# EAGLE design Grownetics 3D Crop Sensor Shield (EAGLE 7.6.0)
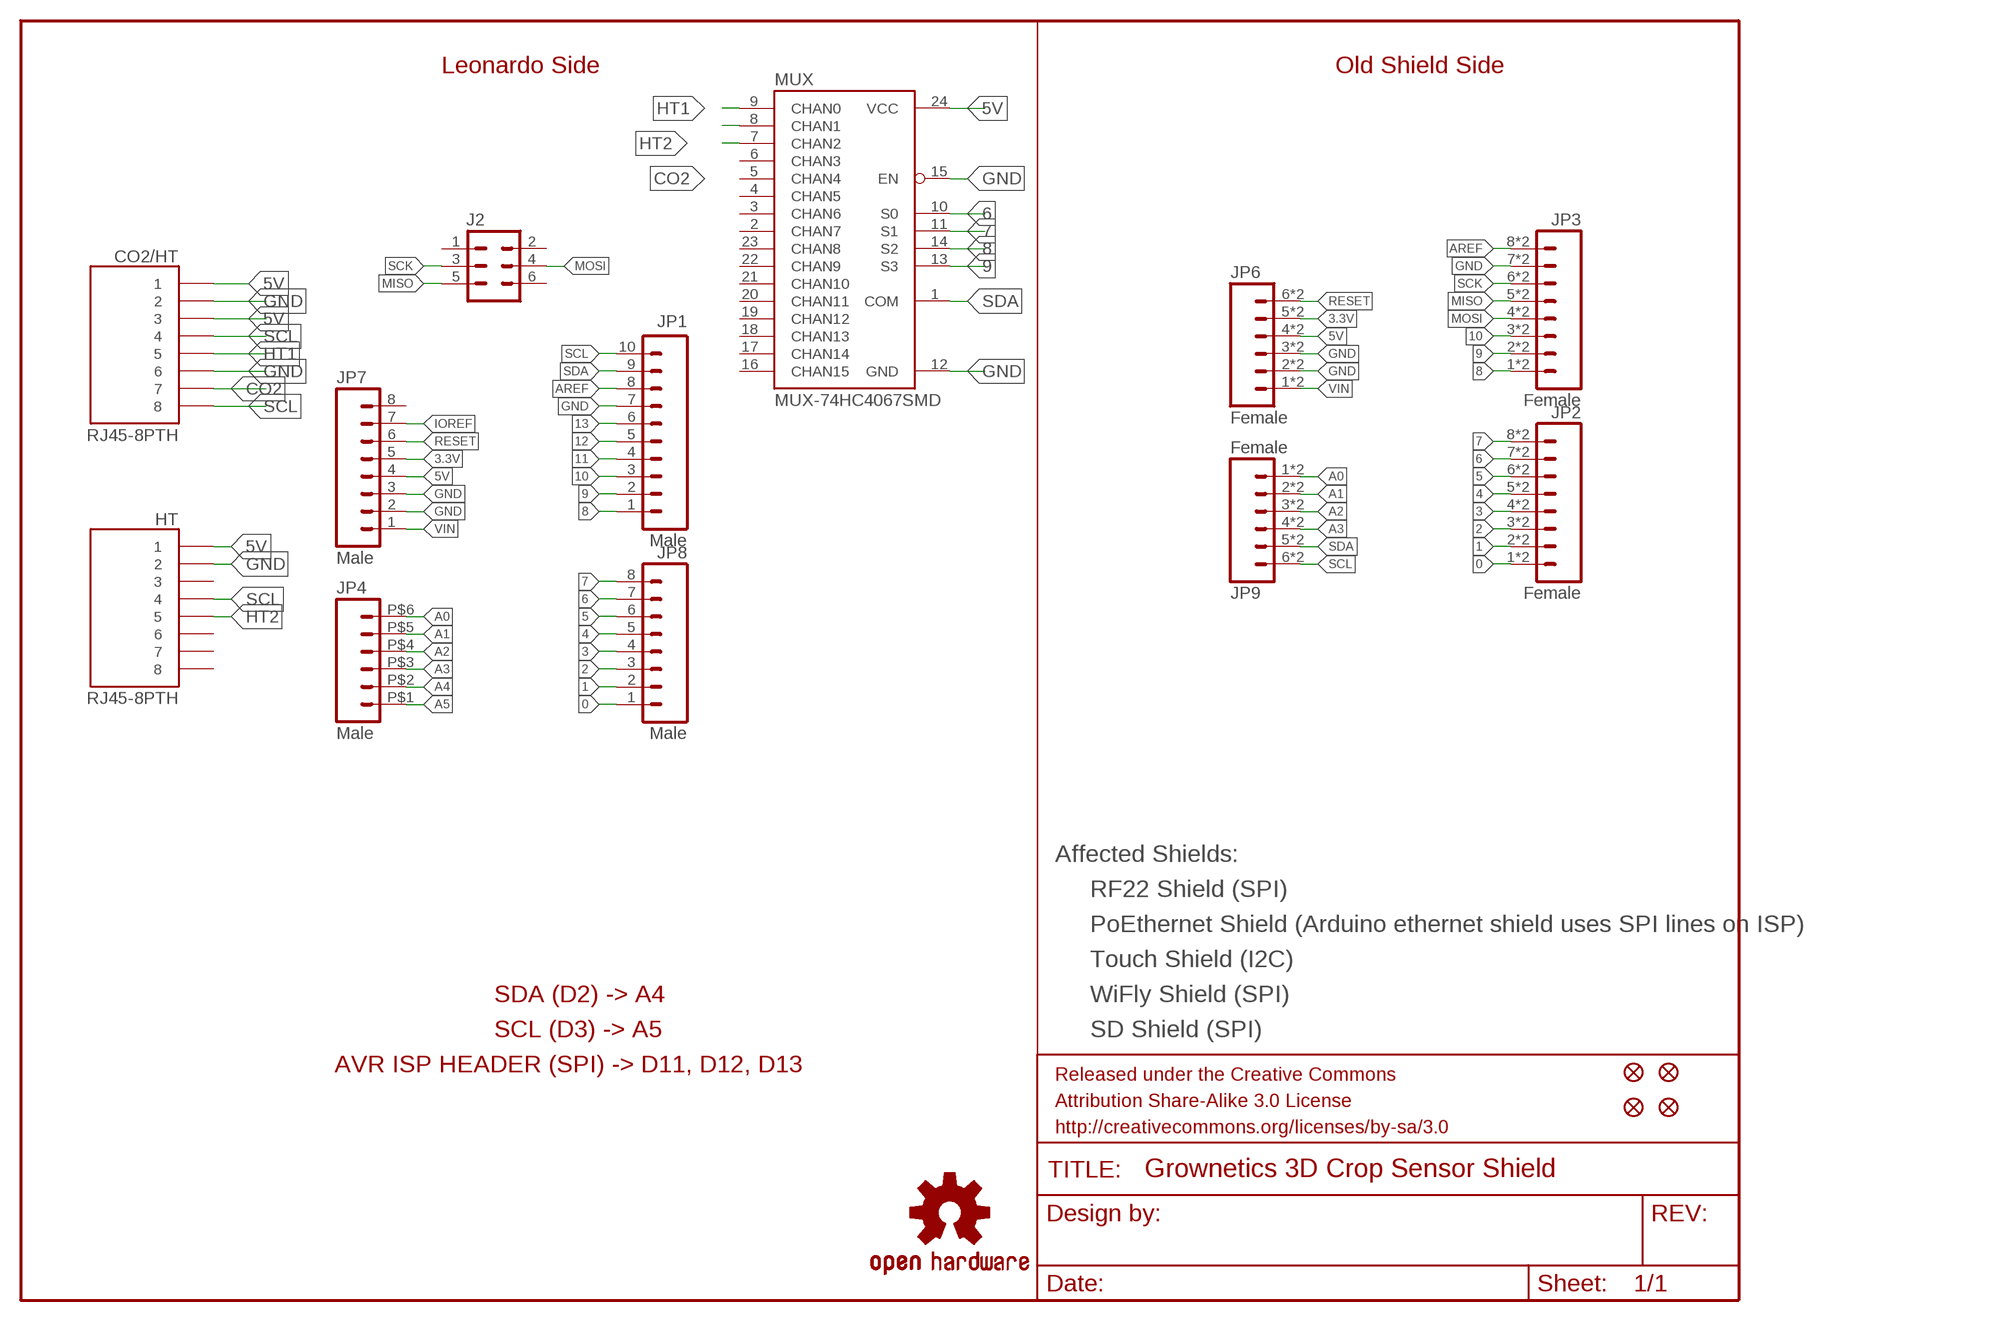
[diagram p0: schematic, sheet 1]

## Parts
CO2/HT  RJ45-8PTH  [RJ45-8]
HT  RJ45-8PTH  [RJ45-8]
J2  Female  M03X2  [2X3_SMD]
JP1  Male  M10SMD_MALE  [1X10_SMD_MALE]
JP2  Female  M08SMD-COMBO  [1X08_SMD_COMBINED]
JP3  Female  M08SMD-COMBO  [1X08_SMD_COMBINED]
JP4  Male  M06SMD_MALE  [1X06_SMD_MALE]
JP6  Female  M06SMD-STRAIGHT-COMBO  [1X06_SMD_STRAIGHT_COMBO]
JP7  Male  M08SMD-MALE  [1X08_SMD_MALE]
JP8  Male  M08SMD-MALE  [1X08_SMD_MALE]
JP9  Female  M06SMD-STRAIGHT-COMBO  [1X06_SMD_STRAIGHT_COMBO]
JP11  FIDUCIALUFIDUCIAL  [MICRO-FIDUCIAL]
JP12  FIDUCIALUFIDUCIAL  [MICRO-FIDUCIAL]
JP13  FIDUCIALUFIDUCIAL  [MICRO-FIDUCIAL]
JP14  FIDUCIALUFIDUCIAL  [MICRO-FIDUCIAL]
MUX  MUX-74HC4067SMD  [SSOP24]
U$1  OSHW-LOGOS  [OSHW-LOGO-S]

## Nets
0: JP2.1 JP2.1@2 JP8.1
1: JP2.2 JP2.2@2 JP8.2
2: JP2.3 JP2.3@2 JP8.3
3: JP2.4 JP2.4@2 JP8.4
3.3V: JP6.5 JP6.5-2 JP7.5
4: JP2.5 JP2.5@2 JP8.5
5: JP2.6 JP2.6@2 JP8.6
5V: CO2/HT.1 CO2/HT.3 HT.1 JP6.4 JP6.4-2 JP7.4 MUX.24(VCC)
6: JP2.7 JP2.7@2 JP8.7 MUX.10(S0)
7: JP2.8 JP2.8@2 JP8.8 MUX.11(S1)
8: JP1.1 JP3.1 JP3.1@2 MUX.14(S2)
9: JP1.2 JP3.2 JP3.2@2 MUX.13(S3)
10: JP1.3 JP3.3 JP3.3@2
11: JP1.4
12: JP1.5
13: JP1.6
A0: JP4.P$6 JP9.1 JP9.1-2
A1: JP4.P$5 JP9.2 JP9.2-2
A2: JP4.P$4 JP9.3 JP9.3-2
A3: JP4.P$3 JP9.4 JP9.4-2
A4: JP4.P$2
A5: JP4.P$1
AREF: JP1.8 JP3.8 JP3.8@2
CO2: CO2/HT.7 MUX.7(CHAN2)
GND: CO2/HT.2 CO2/HT.6 HT.2 JP1.7 JP3.7 JP3.7@2 JP6.2 JP6.2-2 JP6.3 JP6.3-2 JP7.2 JP7.3 MUX.12(GND) MUX.15(EN)
HT1: CO2/HT.5 MUX.9(CHAN0)
HT2: HT.5 MUX.8(CHAN1)
IOREF: JP7.7
MISO: J2.5 JP3.5 JP3.5@2
MOSI: J2.4 JP3.4 JP3.4@2
RESET: JP6.6 JP6.6-2 JP7.6
SCK: J2.3 JP3.6 JP3.6@2
SCL: CO2/HT.4 CO2/HT.8 HT.4 JP1.10 JP9.6 JP9.6-2
SDA: JP1.9 JP9.5 JP9.5-2 MUX.1(COM)
VIN: JP6.1 JP6.1-2 JP7.1
Unconnected: HT.3 HT.6 HT.7 HT.8 J2.1 J2.2 J2.6 JP7.8 MUX.2(CHAN7) MUX.3(CHAN6) MUX.4(CHAN5) MUX.5(CHAN4) MUX.6(CHAN3) MUX.16(CHAN15) MUX.17(CHAN14) MUX.18(CHAN13) MUX.19(CHAN12) MUX.20(CHAN11) MUX.21(CHAN10) MUX.22(CHAN9) MUX.23(CHAN8)

## Notes on the sheet
- Leonardo Side | Old Shield Side
- Affected Shields:
- RF22 Shield (SPI)
- PoEthernet Shield (Arduino ethernet shield uses SPI lines on ISP)
- Touch Shield (I2C)
- SDA (D2) -> A4 | WiFly Shield (SPI)
- SCL (D3) -> A5 | SD Shield (SPI)
- AVR ISP HEADER (SPI) -> D11, D12, D13

## Library data of the parts
CO2/HT HT = SparkFun-Connectors:RJ45-8: RJ45 Jack Simple RJ45, 8-pin connection - connector for common Cat5, Cat5e, and Cat6 Ethernet cables. Footprint not yet proven in production. Connector sku is PRT-00643; Breakout PCB sku is BOB-00716.
J2 = SparkFun-Connectors:M03X2
JP1 = SparkFun-Connectors:M10: Header 10 Standard 10-pin 0.1" header. Use with straight break away headers (SKU : PRT-00116), right angle break away headers (PRT-00553), swiss pins (PRT-00743), machine pins (PRT-00117), and female headers (PRT-00115).
JP2 JP3 JP7 JP8 = SparkFun-Connectors:M08: Header 8 Standard 8-pin 0.1" header. Use with straight break away headers (SKU : PRT-00116), right angle break away headers (PRT-00553), swiss pins (PRT-00743), machine pins (PRT-00117), and female headers (PRT-00115).
JP4 JP6 JP9 = SparkFun-Connectors:M06: Header 6 Standard 6-pin 0.1" header. Use with straight break away headers (SKU : PRT-00116), right angle break away headers (PRT-00553), swiss pins (PRT-00743), machine pins (PRT-00117), and female headers (PRT-00115). Molex polarized connector foot print use with SKU : PRT-08094 with associated crimp pins and housings. NOTES ON THE VARIANTS LOCK and LOCK_LONGPADS... This footprint was designed to help hold the alignment of a through-hole component (i.e. 6-pin header) while soldering it into place. You may notice that each hole has been shifted either up or down by 0.005 of an inch from it's more standard position (which is a perfectly straight line). This slight alteration caused the pins (the squares in the middle) to touch the edges of the holes. Because they are alternating, it causes a "brace" to hold the component in place. 0.005 has proven to be the perfect amount of "off-center" position when using our standard breakaway headers. Although looks a little odd when you look at the bare footprint, once you have a header in there, the alteration is very hard to notice. Also, if you push a header all the way into place, it is covered up entirely on the bottom side. This idea of altering the position of holes to aid alignment will be further integrated into the Sparkfun Library for other footprints. It can help hold any component with 3 or more connection pins.
JP11-JP14 = SparkFun:FIDUCIAL: Fiducial Alignment Points Various fiducial points for machine vision alignment.
MUX = SparkFun-AnalogIC:MUX-74HC4067: 16-channel analog MUX
U$1 = SparkFun-Aesthetics:OSHW-LOGO: Open Source Hardware Logo This logo indicates the piece of hardware it is found on incorporates a OSHW license and/or adheres to the definition of open source hardware found here: http://freedomdefined.org/OSHW

## Board
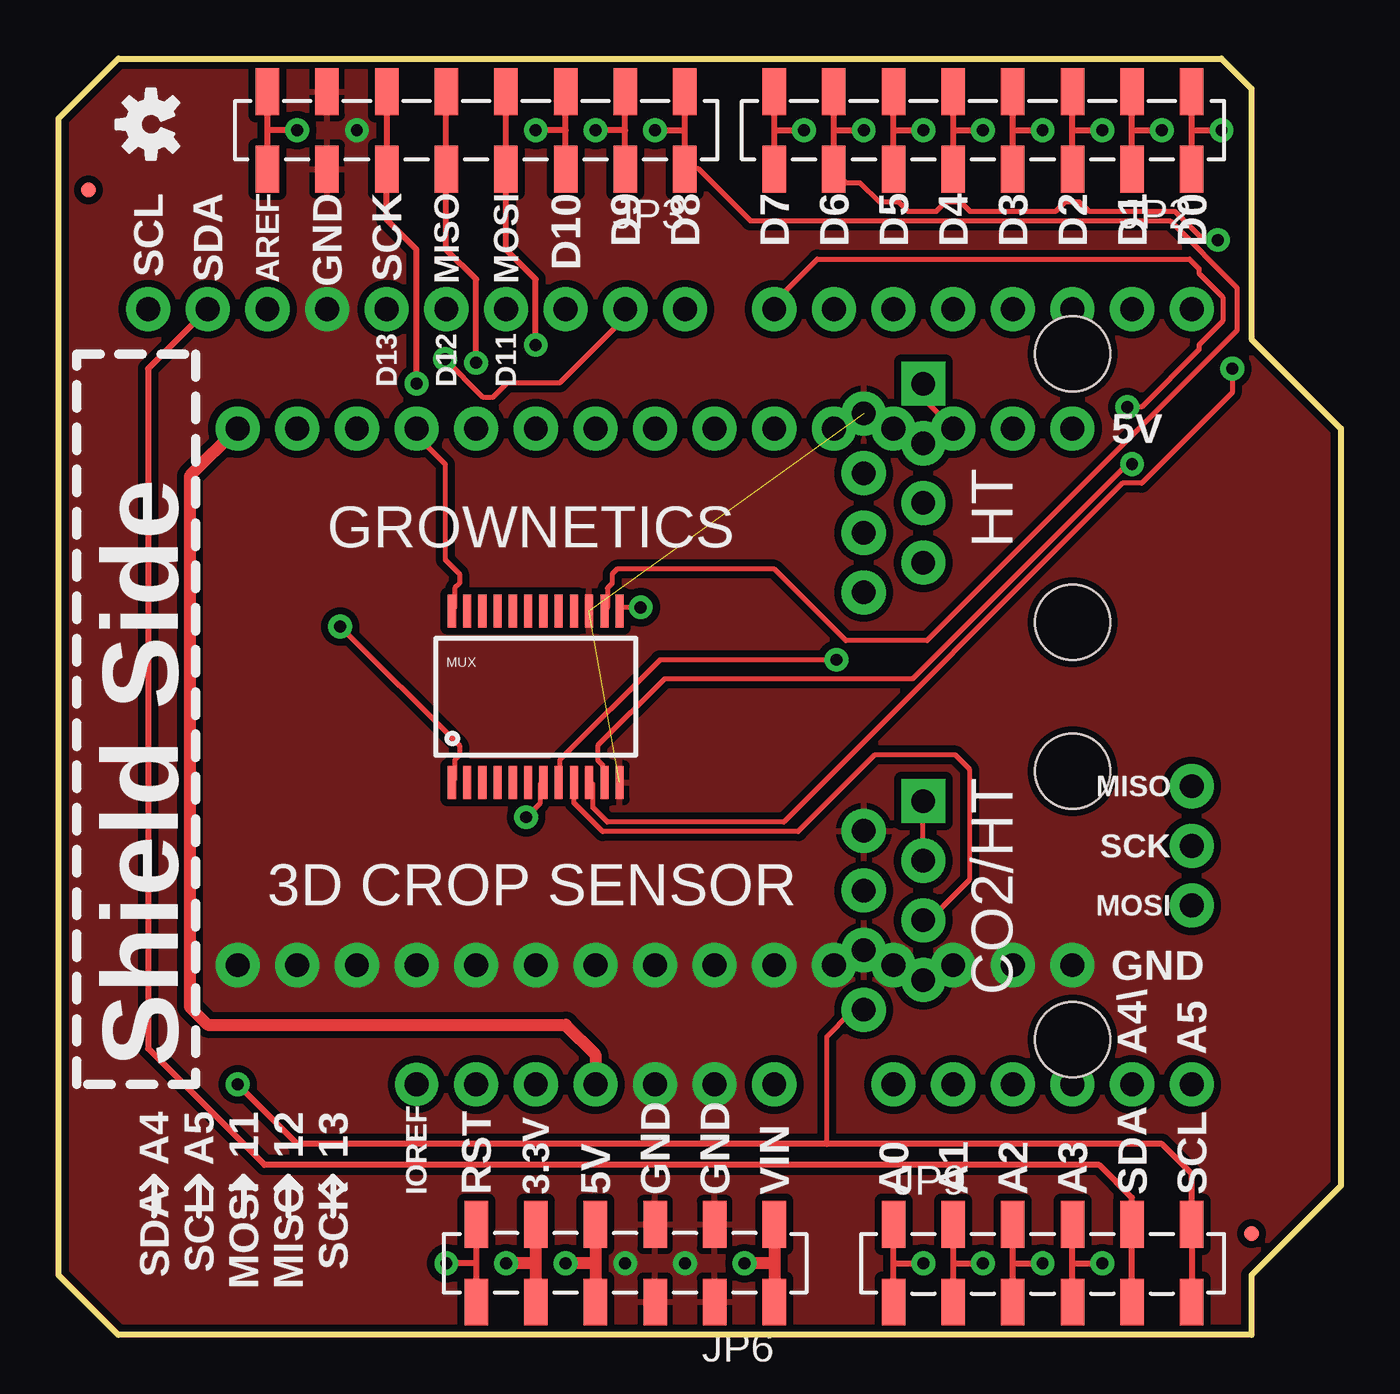
[diagram p1: board, top side]
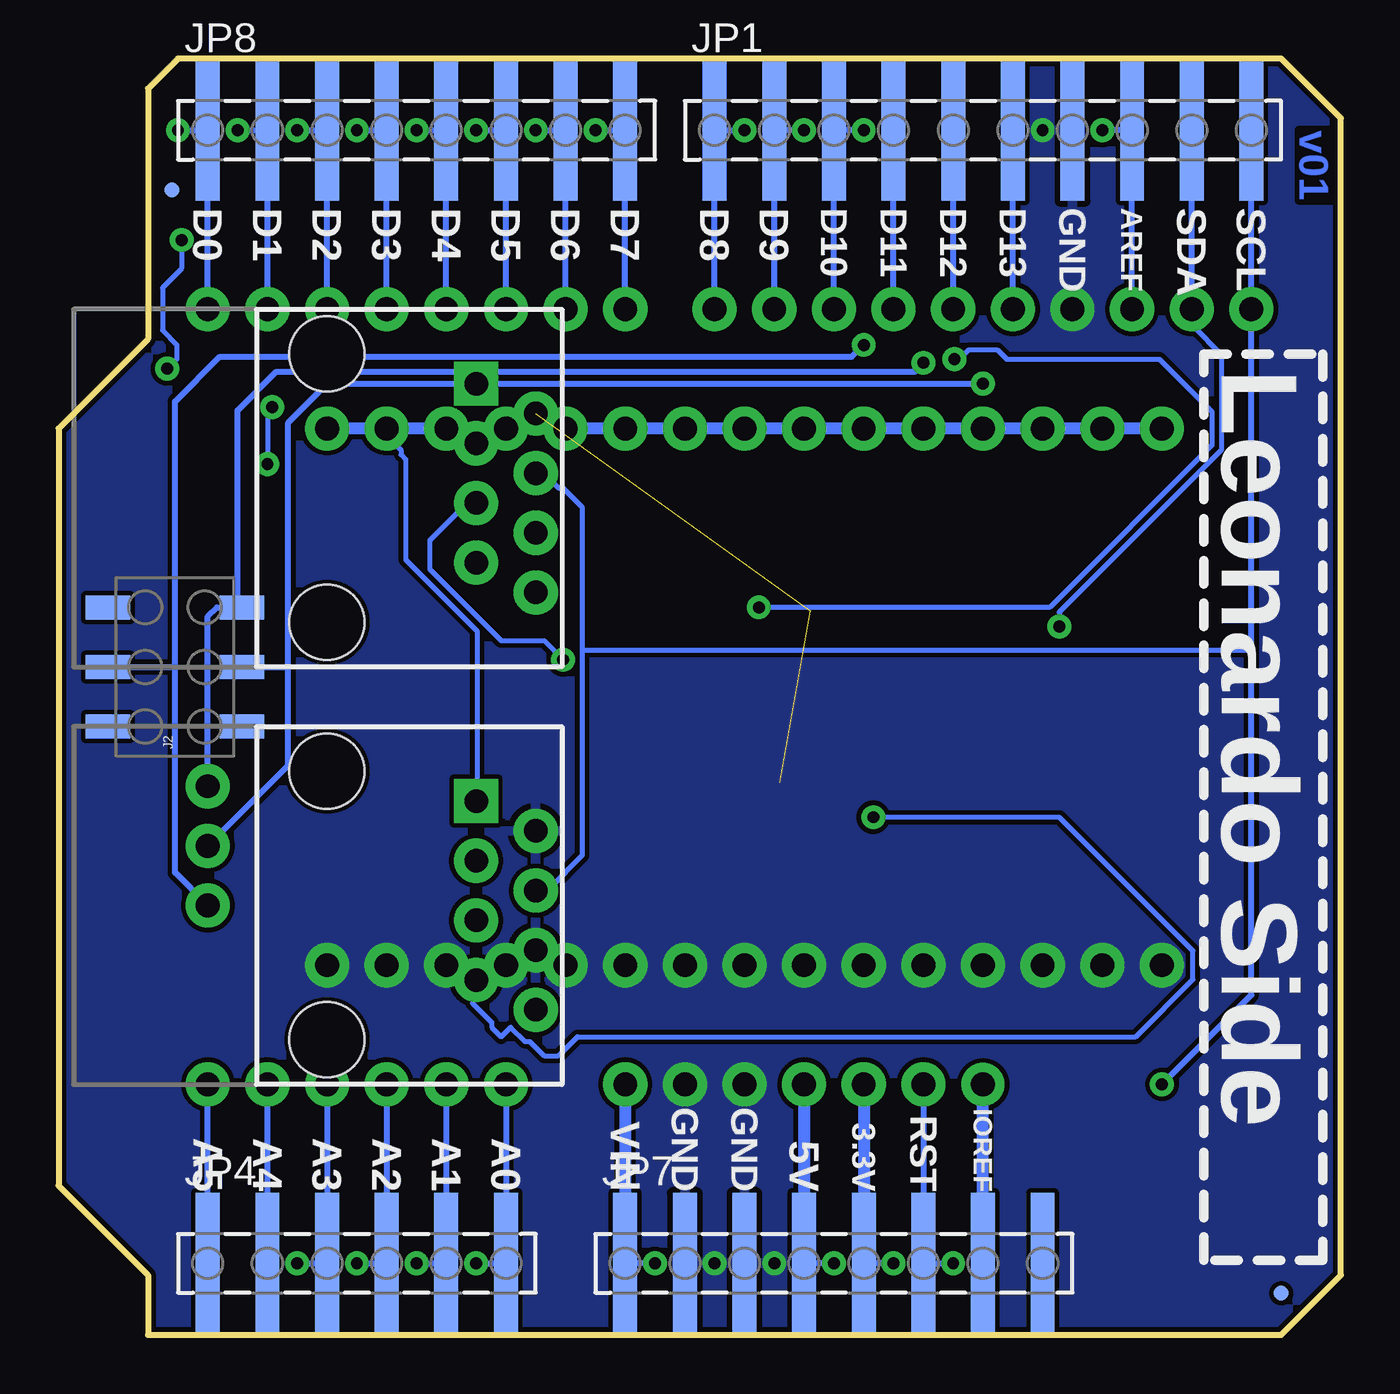
[diagram p2: board, bottom side, seen from below]

Size 54.61 x 54.36 mm. Coordinates in mm from the lower left corner, seen from the top.
Outline: 2.54,0 0,2.54 0,51.82 2.54,54.36 49.53,54.36 50.8,53.09 50.8,42.42 54.61,38.61 54.61,6.35 50.8,2.54 50.8,0 2.54,0
Copper layers (1*16): Top 0.035mm / dielectric 1.5mm / Bottom 0.035mm
Design rules "default": minimum track width 8mil, minimum drill 20mil, track to track 8mil, track to pad 8mil, pad to pad 8mil, via to via 8mil, smd to smd 8mil, copper to edge 8mil, drill to drill 8mil, minimum pad ring 12mil, minimum via ring 10mil, stop-mask expansion 4mil, vias tented up to drill 20mil, thermal gap 10mil

### Footprints (pad centres in the part's own frame; a part is rotated, then mirrored left to right if it is on the bottom)
RJ45-8 = drill 1 pad 1.88 square: 1 -4.445,6.35 | drill 1 pad 1.88: 2 -3.175,8.89; 3 -1.905,6.35; 4 -0.635,8.89; 5 0.635,6.35; 6 1.905,8.89; 7 3.175,6.35; 8 4.445,8.89 | hole 3.2: -5.715,0; 5.715,0
2X3_SMD = smd 1.02 x 1.9: 1 -2.54,-2.85; 2 -2.54,2.85; 3 0,-2.85; 4 0,2.85; 5 2.54,-2.85; 6 2.54,2.85
1X10_SMD_MALE = smd 1.02 x 6: 1 0,0; 2 2.54,0; 3 5.08,0; 4 7.62,0; 5 10.16,0; 6 12.7,0; 7 15.24,0; 8 17.78,0; 9 20.32,0; 10 22.86,0
1X08_SMD_COMBINED = smd 1 x 2: 1 0,1.65; 1@2 0,-1.65; 2 2.54,-1.65; 2@2 2.54,1.65; 3 5.08,1.65; 3@2 5.08,-1.65; 4 7.62,-1.65; 4@2 7.62,1.65; 5 10.16,1.65; 5@2 10.16,-1.65; 6 12.7,-1.65; 6@2 12.7,1.65; 7 15.24,1.65; 7@2 15.24,-1.65; 8 17.78,-1.65; 8@2 17.78,1.65
1X06_SMD_MALE = smd 1.02 x 6: P$1 0,0; P$2 2.54,0; P$3 5.08,0; P$4 7.62,0; P$5 10.16,0; P$6 12.7,0
1X06_SMD_STRAIGHT_COMBO = smd 1 x 2: 1 0,-1.65; 1-2 0,1.65; 2 2.54,1.65; 2-2 2.54,-1.65; 3 5.08,-1.65; 3-2 5.08,1.65; 4 7.62,1.65; 4-2 7.62,-1.65; 5 10.16,-1.65; 5-2 10.16,1.65; 6 12.7,1.65; 6-2 12.7,-1.65
1X08_SMD_MALE = smd 1.02 x 6: 1 0,0; 2 2.54,0; 3 5.08,0; 4 7.62,0; 5 10.16,0; 6 12.7,0; 7 15.24,0; 8 17.78,0
MICRO-FIDUCIAL = smd 0.635 x 0.635: 1 0,0
SSOP24 = smd 0.348 x 1.397: 1 -3.575,-3.656; 2 -2.925,-3.656; 3 -2.275,-3.656; 4 -1.625,-3.656; 5 -0.975,-3.656; 6 -0.325,-3.656; 7 0.325,-3.656; 8 0.975,-3.656; 9 1.625,-3.656; 10 2.275,-3.656; 11 2.925,-3.656; 12 3.575,-3.656; 13 3.575,3.656; 14 2.925,3.656; 15 2.275,3.656; 16 1.625,3.656; 17 0.975,3.656; 18 0.325,3.656; 19 -0.325,3.656; 20 -0.975,3.656; 21 -1.625,3.656; 22 -2.275,3.656; 23 -2.925,3.656; 24 -3.575,3.656

### Placement (x,y rotation side)
CO2/HT  43.18,18.29 270 bottom
HT  43.18,36.07 270 bottom
J2  49.66,28.45 90 bottom
JP1  26.67,51.31 0 bottom
JP2  48.26,51.31 180 top
JP3  26.67,51.31 180 top
JP4  48.26,3.05 0 bottom
JP6  30.48,3.05 180 top
JP7  30.48,3.05 0 bottom
JP8  48.26,51.31 0 bottom
JP9  35.56,3.05 0 top
JP11  50.8,4.32 0 top
JP12  1.27,48.77 0 top
JP13  2.54,1.78 0 bottom
JP14  49.78,48.77 0 bottom
MUX  20.32,27.18 0 top
U$1  3.94,51.56 90 top

### Tracks (layer width: path | path; a pad name or v marks a point on that pad's centre or on a via)
0  (via drill 0.51, 1.02 pad 1.88)
  Top 0.254: JP2.1 JP8.1 | JP8.1 JP2.1@2 | JP8.1 v49.53,51.31
  Bottom 0.254: v48.26,43.69 JP8.1 v49.53,51.31
1  (via drill 0.51, 1.02 pad 1.88)
  Top 0.254: JP2.2@2 JP8.2 | JP8.2 JP2.2 | JP8.2 v46.99,51.31
  Bottom 0.254: v45.72,43.69 JP8.2 v46.99,51.31
2  (via drill 0.51, 1.02 pad 1.88)
  Top 0.254: JP2.3 JP8.3 | JP8.3 JP2.3@2 | JP8.3 v44.45,51.31
  Bottom 0.254: v43.18,43.69 JP8.3 v44.45,51.31
3  (via drill 0.51, 1.02 pad 1.88)
  Top 0.254: JP2.4@2 JP8.4 | JP8.4 JP2.4 | JP8.4 v41.91,51.31
  Bottom 0.254: v40.64,43.69 JP8.4 v41.91,51.31
3.3V  (via drill 0.51, 1.02 pad 1.88)
  Top 0.508: JP6.5 JP7.5 | JP7.5 JP6.5-2 | JP7.5 v19.05,3.05
  Bottom 0.254: v19.05,3.05 JP7.5
  Bottom 0.508: v20.32,10.67 JP7.5
4  (via drill 0.51, 1.02 pad 1.88)
  Top 0.254: JP2.5 JP8.5 | JP8.5 JP2.5@2 | JP8.5 v39.37,51.31
  Bottom 0.254: v38.1,43.69 JP8.5 v39.37,51.31
5  (via drill 0.51, 1.02 pad 1.88)
  Top 0.254: JP2.6@2 JP8.6 | JP8.6 JP2.6 | JP8.6 v36.83,51.31
  Bottom 0.254: v35.56,43.69 JP8.6 v36.83,51.31
5V  (via drill 0.51, 1.02 pad 1.88)
  Top 0.203: CO2/HT.3 36.78,20.22 36.78,22.66 CO2/HT.1 | v15.24,38.61 15.24,38.3 16.46,37.08 16.46,33.02 17.07,32.41 17.07,32 16.87,31.8 16.87,30.99 MUX.24 | v38.1,38.61 36.98,39.73 36.98,40.34 HT.1
  Top 0.508: v7.62,38.61 5.59,36.58 5.59,13.97 6.35,13.21 21.59,13.21 22.86,11.94 v22.86,10.67 | JP6.4-2 JP7.4 | JP7.4 JP6.4 | JP7.4 v21.59,3.05
  Bottom 0.203: CO2/HT.1 36.78,22.86 36.78,29.97 39.83,33.02 39.83,37.29 40.03,37.49 40.03,37.69 40.23,37.9 40.23,38.51 v40.64,38.61
  Bottom 0.254: v21.59,3.05 JP7.4
  Bottom 0.508: v7.62,38.61 v10.16,38.61 v12.7,38.61 v15.24,38.61 v17.78,38.61 v20.32,38.61 v22.86,38.61 v25.4,38.61 v27.94,38.61 v30.48,38.61 v33.02,38.61 v35.56,38.61 v38.1,38.61 v40.64,38.61 v43.18,38.61 | v22.86,10.67 JP7.4
6  (via drill 0.51, 1.02 pad 1.88)
  Top 0.203: v49.99,41.15 49.99,40.13 46.13,36.27 45.31,36.27 30.89,21.84 23.37,21.84 22.76,22.45 22.76,23.47 MUX.10 | v49.38,46.63 48.77,46.63 47.55,47.85 43.89,47.85 43.48,48.26 42.88,48.26 42.47,47.85 38.81,47.85 38.41,48.26 37.8,48.26 37.39,47.85 36.17,47.85 35.76,48.26 34.95,48.26 34.14,49.07 33.53,49.07 33.12,49.48 JP2.7
  Top 0.254: JP2.7 JP8.7 | JP8.7 JP2.7@2 | JP8.7 v34.29,51.31
  Bottom 0.203: v49.99,41.15 49.58,41.55 49.58,42.16 50.19,42.77 50.19,44.6 49.38,45.41 v49.38,46.63
  Bottom 0.254: v33.02,43.69 JP8.7 v34.29,51.31
7  (via drill 0.51, 1.02 pad 1.88)
  Top 0.203: v45.72,37.08 45.52,37.08 36.37,27.94 25.81,27.94 22.96,25.09 22.96,24.49 23.16,24.28 23.16,23.67 MUX.11 | v45.52,39.52 46.13,39.52 48.56,41.96 48.56,42.16 49.58,43.18 49.58,44.2 48.56,45.21 48.56,45.41 48.16,45.82 32.31,45.82 30.48,43.99 v30.48,43.69
  Top 0.254: JP2.8@2 JP8.8 | JP8.8 JP2.8 | JP8.8 v31.75,51.31
  Bottom 0.203: v45.72,37.08 45.72,39.32 v45.52,39.52
  Bottom 0.254: v30.48,43.69 JP8.8 v31.75,51.31
8  (via drill 0.51, 1.02 pad 1.88)
  Top 0.203: MUX.14 23.37,30.99 23.37,31.8 23.57,32 23.57,32.41 23.77,32.61 30.48,32.61 33.53,29.57 36.98,29.57 50.19,42.77 50.19,44.6 47.35,47.45 29.46,47.45 27.23,49.68 26.82,49.68 JP3.1
  Top 0.254: JP3.1 JP1.1 | JP1.1 JP3.1@2 | v25.4,51.31 JP1.1
  Bottom 0.254: v26.67,43.69 JP1.1 v25.4,51.31
9  (via drill 0.51, 1.02 pad 1.88)
  Top 0.203: v24.79,30.99 23.98,30.99 MUX.13 | v16.46,41.55 18.09,39.93 18.49,39.93 19.1,40.54 21.34,40.54 23.98,43.18 23.98,43.59 v24.13,43.69
  Top 0.254: JP3.2@2 JP1.2 | JP1.2 JP3.2 | JP1.2 v22.86,51.31
  Bottom 0.203: v24.79,30.99 12.39,30.99 5.49,37.9 5.49,39.32 7.72,41.55 14.22,41.55 14.63,41.96 15.85,41.96 16.05,41.76 16.26,41.76 v16.46,41.55
  Bottom 0.254: v24.13,43.69 JP1.2 v22.86,51.31
10  (via drill 0.51, 1.02 pad 1.88)
  Top 0.254: JP3.3 JP1.3 | JP1.3 JP3.3@2 | JP1.3 v20.32,51.31
  Bottom 0.254: v21.59,43.69 JP1.3 v20.32,51.31
11  (via drill 1.02 pad 1.88)
  Bottom 0.254: v19.05,43.69 JP1.4
12  (via drill 1.02 pad 1.88)
  Bottom 0.254: v16.51,43.69 JP1.5
13  (via drill 1.02 pad 1.88)
  Bottom 0.254: v13.97,43.69 JP1.6
A0  (via drill 0.51, 1.02 pad 1.88)
  Top 0.254: JP9.1 JP4.P$6 | JP4.P$6 JP9.1-2 | JP4.P$6 v36.83,3.05
  Bottom 0.254: v36.83,3.05 JP4.P$6 v35.56,10.67
A1  (via drill 0.51, 1.02 pad 1.88)
  Top 0.254: JP9.2-2 JP4.P$5 | JP4.P$5 JP9.2 | JP4.P$5 v39.37,3.05
  Bottom 0.254: v39.37,3.05 JP4.P$5 v38.1,10.67
A2  (via drill 0.51, 1.02 pad 1.88)
  Top 0.254: JP9.3 JP4.P$4 | JP4.P$4 JP9.3-2 | JP4.P$4 v41.91,3.05
  Bottom 0.254: v41.91,3.05 JP4.P$4 v40.64,10.67
A3  (via drill 0.51, 1.02 pad 1.88)
  Top 0.254: JP9.4-2 JP4.P$3 | JP4.P$3 JP9.4 | JP4.P$3 v44.45,3.05
  Bottom 0.254: v44.45,3.05 JP4.P$3 v43.18,10.67
A4  (via drill 1.02 pad 1.88)
  Bottom 0.254: 45.72,1.4 JP4.P$2 v45.72,10.67
A5  (via drill 1.02 pad 1.88)
  Bottom 0.254: JP4.P$1 v48.26,10.67
AREF  (via drill 0.51, 1.02 pad 1.88)
  Top 0.254: JP3.8@2 JP1.8 | JP1.8 JP3.8 | v10.16,51.31 JP1.8
  Bottom 0.254: v8.89,43.69 JP1.8 v10.16,51.31
CO2  (via drill 0.51)
  Top 0.203: v19.91,22.05 20.52,22.66 20.52,23.47 MUX.7
  Bottom 0.203: v19.91,22.05 11.99,22.05 6.3,16.36 6.3,15.14 8.74,12.7 32.51,12.7 33.33,11.89 33.93,11.89 34.54,12.5 34.75,12.5 35.36,13.11 35.76,12.7 36.17,13.11 36.17,13.31 36.98,14.12 36.98,14.93 CO2/HT.7
GND  (via drill 0.51, 1.02 pad 1.88)  (2 unrouted)
  other vias: 24.13,3.05 12.7,51.31 26.67,3.05 11.43,43.69 7.62,15.75 10.16,15.75 12.7,15.75 15.24,15.75 17.78,15.75 20.32,15.75 22.86,15.75 25.4,15.75 27.94,15.75 30.48,15.75 35.56,15.75 33.02,15.75 38.1,15.75 40.64,15.75 43.18,15.75 25.4,10.67 27.94,10.67
  pour Top (isolate 0.305): 0,55.12 0,-0.76 54.61,-0.76 54.61,55.12
  pour Bottom (isolate 0.305): 0,55.12 0,-0.76 54.61,-0.76 54.61,55.12
  pour Bottom: -1.27,56.39 55.88,56.39 55.88,-2.03 -1.27,-2.03
HT1
  Top 0.203: MUX.9 21.95,23.47 21.95,22.66 23.16,21.44 31.5,21.44 34.75,24.69 38.2,24.69 38.81,24.08 38.81,19.41 36.98,17.58 CO2/HT.5
HT2  (via drill 0.51)
  Top 0.203: v33.12,28.75 25.6,28.75 21.34,24.49 21.34,23.67 MUX.8
  Bottom 0.203: v33.12,28.75 33.93,29.57 35.76,29.57 38.81,32.61 38.81,33.83 37.39,35.26 36.98,35.26 HT.5
IOREF  (via drill 1.02 pad 1.83)
  Bottom 0.254: JP7.7 15.24,1.4
  Bottom 0.508: JP7.7 v15.24,10.67
MISO  (via drill 0.51, 1.02 pad 1.88)
  Top 0.254: JP3.5@2 JP3.5 16.51,46.23 17.78,44.96 v17.78,41.4
  Bottom 0.254: v17.78,41.4 18.16,41.02 45.34,41.02 46.99,39.37 46.99,31.17 J2.5 47.88,30.99 48.26,30.61 v48.26,23.37
MOSI  (via drill 0.51, 1.02 pad 1.88)
  Top 0.254: JP3.4 JP3.4@2 19.05,46.23 20.32,44.96 v20.32,42.16
  Bottom 0.254: J2.4 49.66,28.45 | 49.66,28.45 49.66,19.68 v48.26,18.29 | 49.66,28.45 49.66,39.75 47.75,41.66 20.83,41.66 v20.32,42.16
RESET  (via drill 0.51, 1.02 pad 1.88)
  Top 0.254: JP6.6-2 JP7.6 | JP7.6 JP6.6 | JP7.6 v16.51,3.05
  Bottom 0.254: v17.78,10.67 JP7.6 v16.51,3.05
SCK  (via drill 0.51, 1.02 pad 1.88)
  Top 0.254: JP3.6 JP3.6@2 13.97,47.5 15.24,46.23 v15.24,40.51
  Bottom 0.254: 44.83,28.45 44.83,24.26 v48.26,20.83 | 44.83,28.45 44.83,38.86 43.18,40.51 v15.24,40.51 | J2.3 44.83,28.45
SCL  (via drill 0.51, 1.02 pad 1.88)
  Top 0.203: 32.72,8.13 32.72,12.7 33.73,13.72 34.14,13.72 CO2/HT.8
  Top 0.254: JP9.6-2 JP9.6 48.26,6.86 46.99,8.13 32.72,8.13 10.16,8.13 v7.62,10.67
  Bottom 0.203: 32.31,29.16 32.31,35.26 33.12,36.07 33.33,36.07 34.14,36.88 HT.4 | 32.31,29.16 32.31,20.42 33.73,19 34.14,19 CO2/HT.4 | 32.31,29.16 3.81,29.16
  Bottom 0.254: v7.62,10.67 3.81,14.48 3.81,29.16 v3.81,43.69 JP1.10
SDA  (via drill 0.51, 1.02 pad 1.88)
  Top 0.203: v11.99,30.18 17.07,25.09 17.07,24.69 16.87,24.49 16.87,23.67 MUX.1
  Top 0.254: JP9.5 JP9.5-2 45.72,5.84 44.32,7.24 8.76,7.24 3.81,12.19 3.81,41.15 v6.35,43.69
  Bottom 0.203: v11.99,30.18 11.99,30.79 5.08,37.69 5.08,41.76 6.3,42.98 6.3,43.59 v6.35,43.69
  Bottom 0.254: v6.35,43.69 JP1.9
VIN  (via drill 0.51, 1.02 pad 1.88)
  Top 0.508: JP6.1 JP7.1 | JP7.1 JP6.1-2 | JP7.1 v29.21,3.05
  Bottom 0.254: v29.21,3.05 JP7.1
  Bottom 0.508: v30.48,10.67 JP7.1

### Text on the board
Bottom: v01
tPlace: SCL | SDA | AREF | GND | SCK | MISO | MOSI | D10 | D9 | D8 | D7 | D6 | D5 | D4 | D3 | D2 | D1 | D0 | D13 | D12 | D11 | 5V | MISO | SCK | MOSI | GND | Shield Side | A4\ | A5 | SDA A4 | SCL A5 | MOSI 11 | MISO 12 | SCK 13 | IOREF | RST | 3.3V | 5V | GND | GND | VIN | A0 | A1 | A2 | A3 | SDA | SCL
bPlace: SCL | SDA | AREF | GND | D13 | D12 | D11 | D10 | D9 | D8 | D7 | D6 | D5 | D4 | D3 | D2 | D1 | D0 | Leonardo Side | IOREF | RST | 3.3V | 5V | GND | GND | VIN | A0 | A1 | A2 | A3 | A4 | A5
tNames: GROWNETICS | HT | 3D CROP SENSOR | CO2/HT